# EAGLE design garage-door-opener (EAGLE 7.5.0)
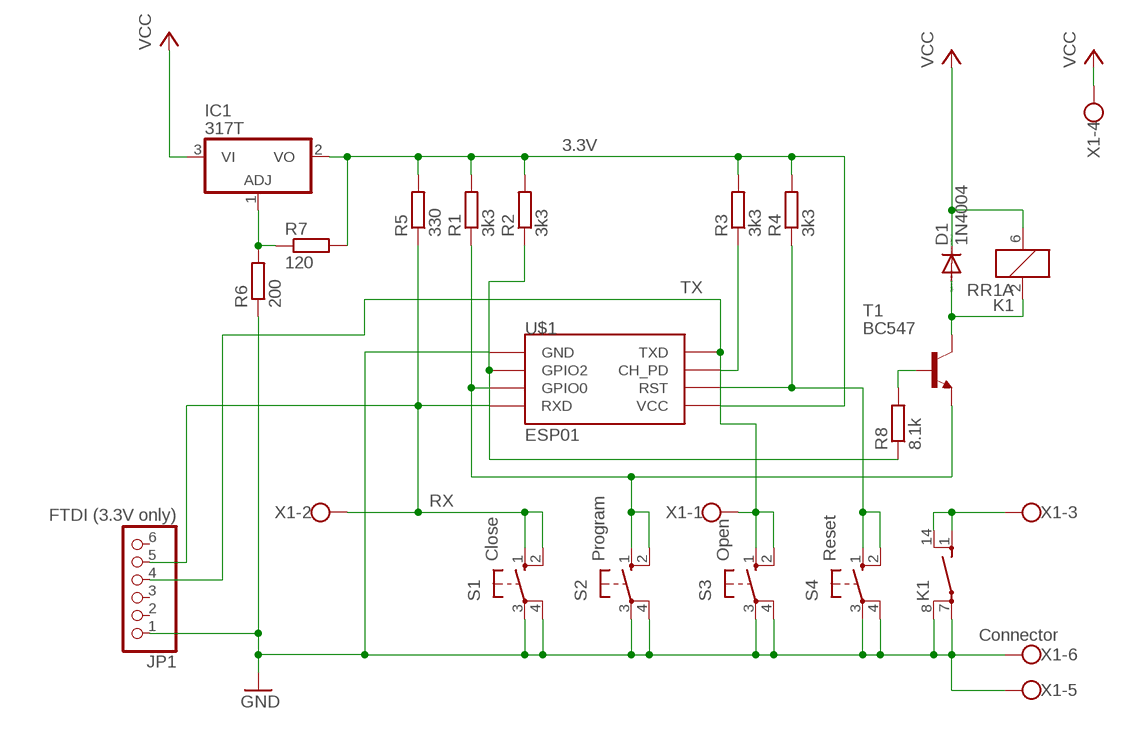
[diagram p0: schematic, sheet 1]

## Parts
D1  1N4004  [DO41-10]
IC1  317T  [TO220H]
JP1  FTDI (3.3V only)  PINHD-1X6  [1X06]
K1  RR1A  [RR1A]
R1  3k3  R-EU_0204/7  [0204/7]
R2  3k3  R-EU_0204/7  [0204/7]
R3  3k3  R-EU_0204/7  [0204/7]
R4  3k3  R-EU_0204/7  [0204/7]
R5  330  R-EU_0204/7  [0204/7]
R6  200  R-EU_0204/7  [0204/7]
R7  120  R-EU_0204/7  [0204/7]
R8  8.1k  R-EU_0204/7  [0204/7]
S1  Close  10-XX  [B3F-10XX]
S2  Program  10-XX  [B3F-10XX]
S3  Open  10-XX  [B3F-10XX]
S4  Reset  10-XX  [B3F-10XX]
T1  BC547  [TO92]
U$1  ESP01  [ESP01]
X1  Connector  W237-6  [W237-6]

## Nets
3.3V: IC1.2(VO) R1.2 R2.2 R3.2 R4.2 R5.2 R7.2 U$1.VCC
GND: JP1.1 K1.7(2:P) K1.8(2:P) R6.1 S1.3(P) S1.4(P1) S2.3(P) S2.4(P1) S3.3(P) S3.4(P1) S4.3(P) S4.4(P1) U$1.GND X1.5 X1.6
N$1: D1.A K1.2 T1.3(C)
N$2: R8.2 T1.2(B)
N$3: IC1.1(ADJ) R6.2 R7.1
N$5: R1.1 S2.1(S) S2.2(S1) T1.1(E) U$1.GPIO0
N$6: R2.1 R8.1 U$1.GPIO2
N$7: R3.1 U$1.CH_PD
N$8: R4.1 S4.1(S) S4.2(S1) U$1.RST
N$10: K1.1(2:S) K1.14(2:S) X1.3
RX: JP1.5 R5.1 S1.1(S) S1.2(S1) U$1.RX(RXD) X1.2
TX: JP1.4 S3.1(S) S3.2(S1) U$1.TX(TXD) X1.1
VCC: D1.C IC1.3(VI) K1.6 X1.4
Unconnected: JP1.2 JP1.3 JP1.6

## Library data of the parts
D1 = diode:1N4004: DIODE general purpose rectifier, 1 A
IC1 = linear:*317: Positive VOLTAGE REGULATOR
JP1 = adafruit:PINHD-1X6: PIN HEADER
K1 = relay:RR1A: RELAY reed, polarity, 1 x norm. open with shield; OC_FARNELL: unknown; OC_NEWARK: unknown
R1-R8 = resistor:R-EU_: RESISTOR, European symbol
S1-S4 = switch-omron:10-XX: OMRON SWITCH; MPN: B3F-1000; OC_FARNELL: 176432; OC_NEWARK: 36M3542
T1 = transistor:BC547: NPN TRANSISTOR
U$1 = esp8266modules:ESP01: ESP8266 Wifi module 01
X1 = con-wago-500:W237-6: WAGO SCREW CLAMP; OC_FARNELL: unknown; OC_NEWARK: unknown

## Board
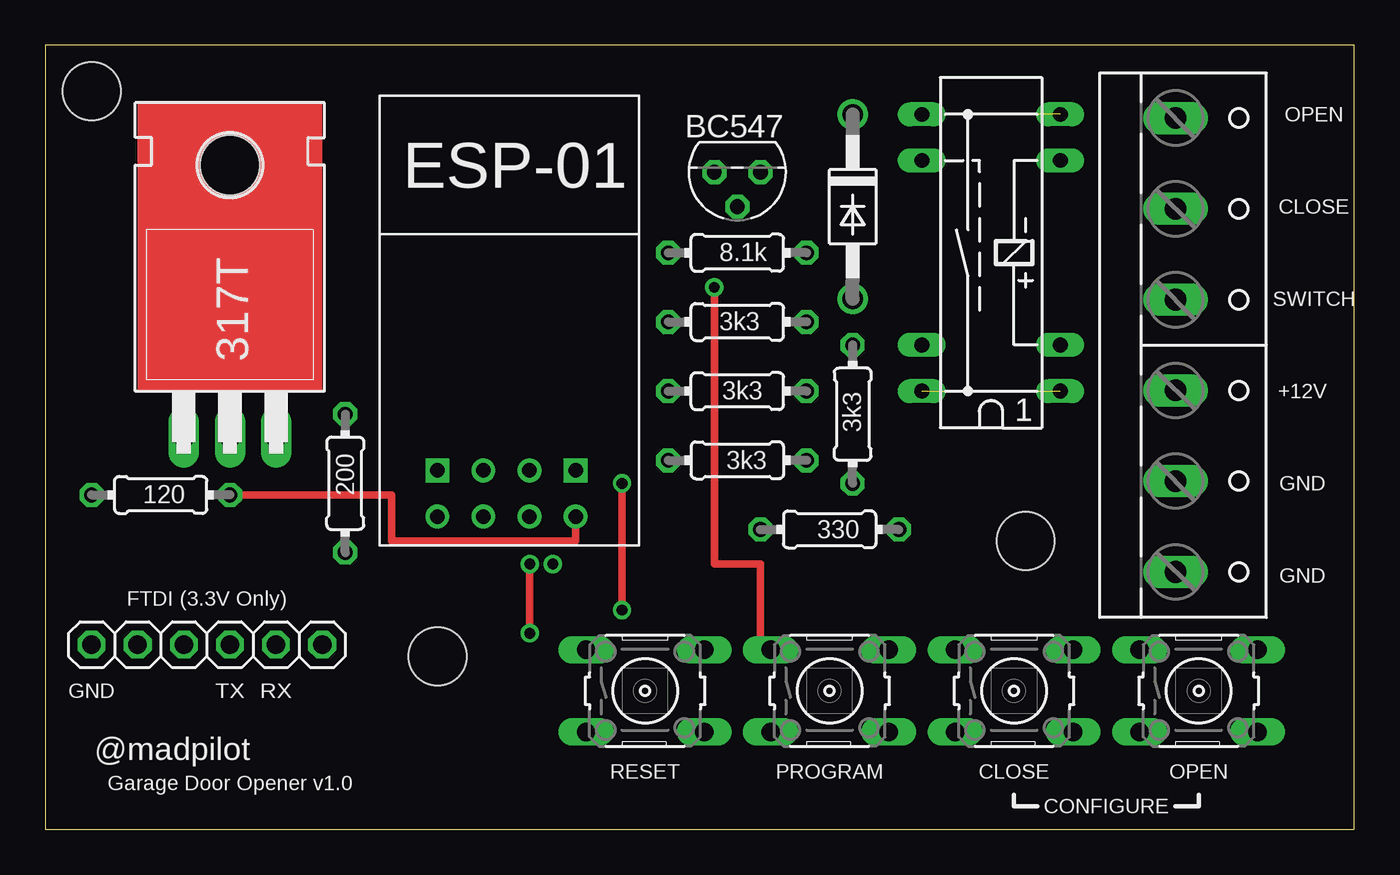
[diagram p1: board, top side]
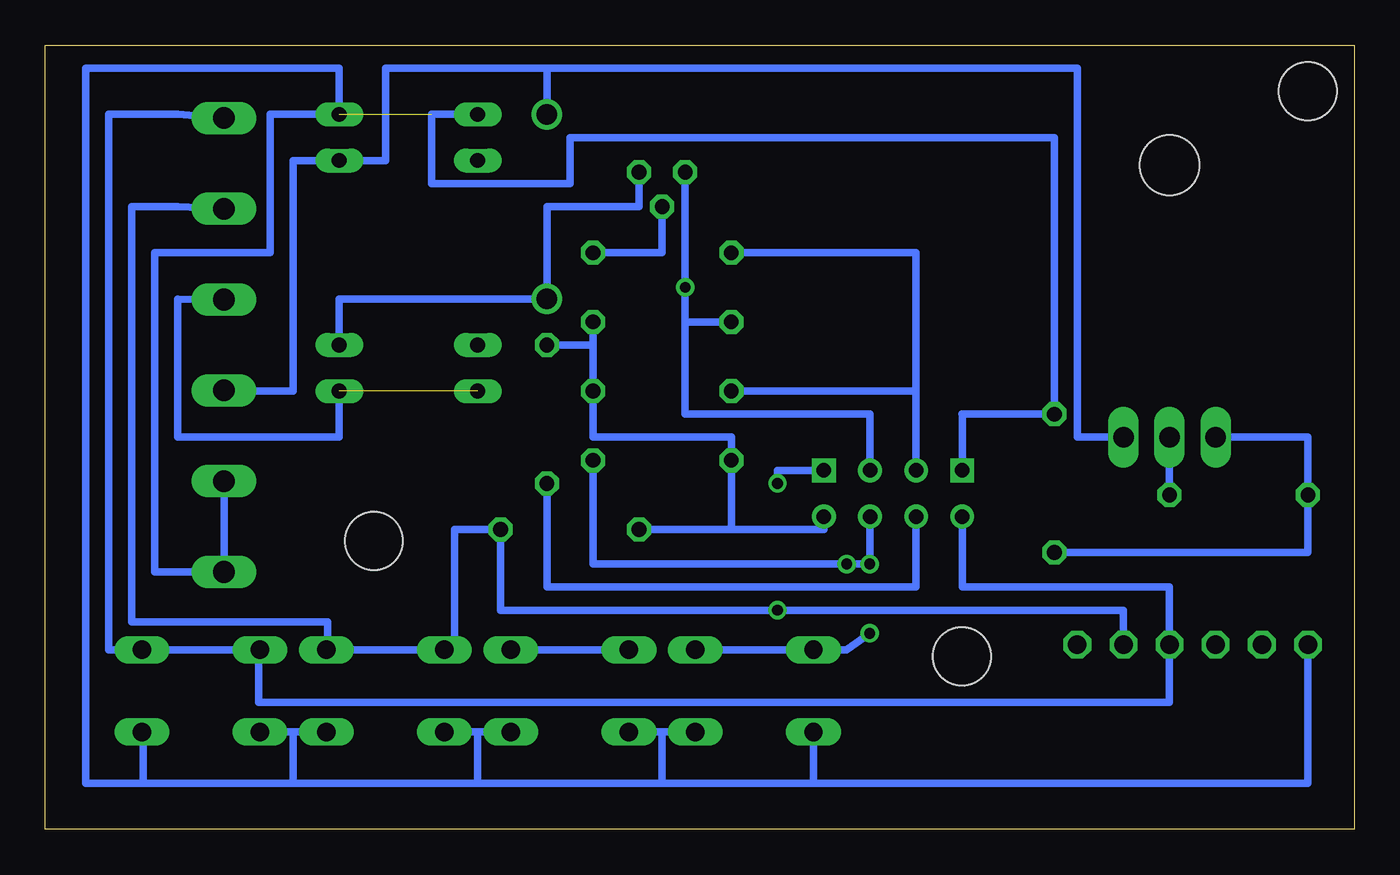
[diagram p2: board, bottom side, seen from below]

Size 72.06 x 43.17 mm. Coordinates in mm from the lower left corner, seen from the top.
Outline: 0,0 72.06,0 72.06,43.17 0,43.17 0,0
Copper layers (1*16): Top 0.035mm / dielectric 1.5mm / Bottom 0.035mm
Design rules "default": minimum track width 10mil, minimum drill 24mil, track to track 8mil, track to pad 8mil, pad to pad 8mil, via to via 8mil, smd to smd 8mil, copper to edge 40mil, drill to drill 8mil, minimum pad ring 10mil, minimum via ring 8mil, stop-mask expansion 4mil, vias tented up to drill 0mil, thermal gap 10mil
Holes 3.2 mm at 21.59,9.52 53.98,15.88 2.54,40.64

### Footprints (pad centres in the part's own frame; a part is rotated, then mirrored left to right if it is on the bottom)
DO41-10 = drill 1.118: A 5.08,0; C -5.08,0
TO220H = drill 1.118 long: 1 -2.54,-10.16; 2 0,-10.16; 3 2.54,-10.16 | hole 3.302: 0,4.826
1X06 = drill 1.016 octagon: 1 -6.35,0; 2 -3.81,0; 3 -1.27,0; 4 1.27,0; 5 3.81,0; 6 6.35,0
RR1A = drill 0.813 long: 1 -7.62,-3.81; 2 -5.08,-3.81; 6 5.08,-3.81; 7 7.62,-3.81; 8 7.62,3.81; 9 5.08,3.81; 13 -5.08,3.81; 14 -7.62,3.81
0204/7 = drill 0.813 octagon: 1 -3.81,0; 2 3.81,0
B3F-10XX = drill 1.016 long: 1 -3.251,2.261; 2 3.251,2.261; 3 -3.251,-2.261; 4 3.251,-2.261
TO92 = drill 0.813 octagon: 1 1.27,0; 2 0,1.905; 3 -1.27,0
ESP01 = drill 0.8: CH_PD -1.285,-8.178; GPIO0 1.255,-5.638; GPIO2 -1.285,-5.638; RST 1.255,-8.178; TX -3.825,-8.178; VCC 3.795,-8.178 | drill 0.8 square: GND -3.825,-5.638; RX 3.795,-5.638
W237-6 = drill 1.194 long: 1 -12.5,-1.27; 2 -7.5,-1.27; 3 -2.5,-1.27; 4 2.5,-1.27; 5 7.5,-1.27; 6 12.5,-1.27

### Placement (x,y rotation side)
D1  44.45,34.29 270 top
IC1  10.16,31.75 0 top
JP1  8.89,10.16 0 top
K1  52.07,31.75 90 top
R1  38.1,27.94 0 top
R2  38.1,24.13 0 top
R3  44.45,22.86 90 top
R4  38.1,20.32 180 top
R5  43.18,16.51 180 top
R6  16.51,19.05 270 top
R7  6.35,18.41 0 top
R8  38.1,31.75 0 top
S1  53.34,7.62 0 top
S2  43.18,7.62 0 top
S3  63.5,7.62 0 top
S4  33.02,7.62 0 top
T1  38.1,36.2 180 top
U$1  25.4,25.4 0 top
X1  63.5,26.67 270 top

### Tracks (layer width: path | path; a pad name or v marks a point on that pad's centre or on a via)
3.3V
  Top 0.406: R7.2 19.05,18.41 19.05,15.88 29.2,15.88 U$1.VCC
  Bottom 0.406: IC1.2 R7.2 | 41.91,26.67 R2.2 41.91,21.59 34.29,21.59 R4.2 34.29,16.51 | 41.91,26.67 R1.2 | 34.29,16.51 R5.2 | 34.29,16.51 29.2,16.51 U$1.VCC | R3.2 41.91,26.67
GND  (1 unrouted)
  Bottom 0.406: 29.77,2.54 2.54,2.54 JP1.1 | 38.1,5.36 S2.3 | 66.67,2.54 69.85,2.54 69.85,41.91 55.88,41.91 K1.7 59.69,39.37 59.69,31.75 66.04,31.75 66.04,14.17 X1.6 X1.5 | 66.67,2.54 58.42,2.54 | 58.42,2.54 48.26,2.54 | 48.26,2.54 38.1,2.54 | S3.4 66.67,5.36 66.67,2.54 | 48.26,5.36 S1.3 | S1.4 58.42,5.36 | S4.4 38.1,5.36 | 38.1,5.36 38.1,2.54 | S2.4 48.26,5.36 | 48.26,5.36 48.26,2.54 | S3.3 58.42,5.36 | 58.42,5.36 58.42,2.54 | 38.1,2.54 29.77,2.54 | 29.77,2.54 S4.3 | 21.57,22.86 R6.1 16.51,38.1 43.18,38.1 43.18,35.56 50.8,35.56 50.8,39.37 K1.8 | 21.59,22.86 21.57,22.86 | 21.57,22.86 U$1.GND
N$1
  Bottom 0.406: K1.2 55.88,29.21 D1.A 44.45,34.29 39.37,34.29 T1.3
N$2
  Bottom 0.406: T1.2 38.1,31.75 R8.2
N$3
  Bottom 0.406: R6.2 2.54,15.24 R7.1 2.54,21.59 IC1.1
N$5  (via drill 0.6)
  Top 0.406: S2.1 39.37,9.88 39.37,14.61 36.83,14.61 v36.83,29.84
  Bottom 0.406: R1.1 36.83,27.94 | 36.83,27.94 36.83,22.86 26.66,22.86 U$1.GPIO0 | T1.1 v36.83,29.84 36.83,27.94 | S2.2 S2.1
N$6
  Bottom 0.406: U$1.GPIO2 24.13,19.76 24.13,24.13 | 24.13,24.13 R2.1 | R8.1 24.13,31.75 24.13,24.13
N$7
  Bottom 0.406: U$1.CH_PD 24.13,17.22 24.13,13.34 44.45,13.34 R3.1
N$8  (via drill 0.6)
  Top 0.406: v26.67,10.8 v26.67,14.61
  Bottom 0.406: U$1.RST 26.67,17.22 v26.67,14.61 v27.94,14.61 41.91,14.61 R4.1 | v26.67,10.8 27.94,9.88 S4.1 S4.2
N$10  (1 unrouted)
  Bottom 0.406: K1.1 55.88,21.59 64.77,21.59 64.77,29.21 X1.3
RX  (via drill 0.6)
  Top 0.406: v31.75,19.05 v31.75,12.07
  Bottom 0.406: X1.2 64.77,34.29 67.31,34.29 67.31,11.43 56.52,11.43 56.52,9.88 S1.2 S1.1 49.53,9.88 49.53,16.51 R5.1 46.99,12.07 v31.75,12.07 12.7,12.07 JP1.5 | U$1.RX 31.75,19.76 v31.75,19.05
TX
  Bottom 0.406: X1.1 64.77,39.37 68.58,39.37 68.58,9.88 S3.2 60.33,9.88 | U$1.TX 21.57,13.34 10.16,13.34 JP1.4 10.16,6.98 60.33,6.98 60.33,9.88 | S3.1 60.33,9.88
VCC
  Bottom 0.406: X1.4 60.96,24.17 60.96,24.13 58.42,24.13 58.42,36.83 K1.6 53.34,36.83 53.34,41.91 44.45,41.91 | D1.C 44.45,41.91 | 44.45,41.91 15.24,41.91 15.24,21.59 IC1.3
(copper drawn outside any net)
  shapes: Top area x1

### Text on the board
tPlace: OPEN | CLOSE | SWITCH | +12V | GND | GND | FTDI (3.3V Only) | GND | TX | RX | @madpilot | RESET | PROGRAM | CLOSE | OPEN | Garage Door Opener v1.0 | CONFIGURE